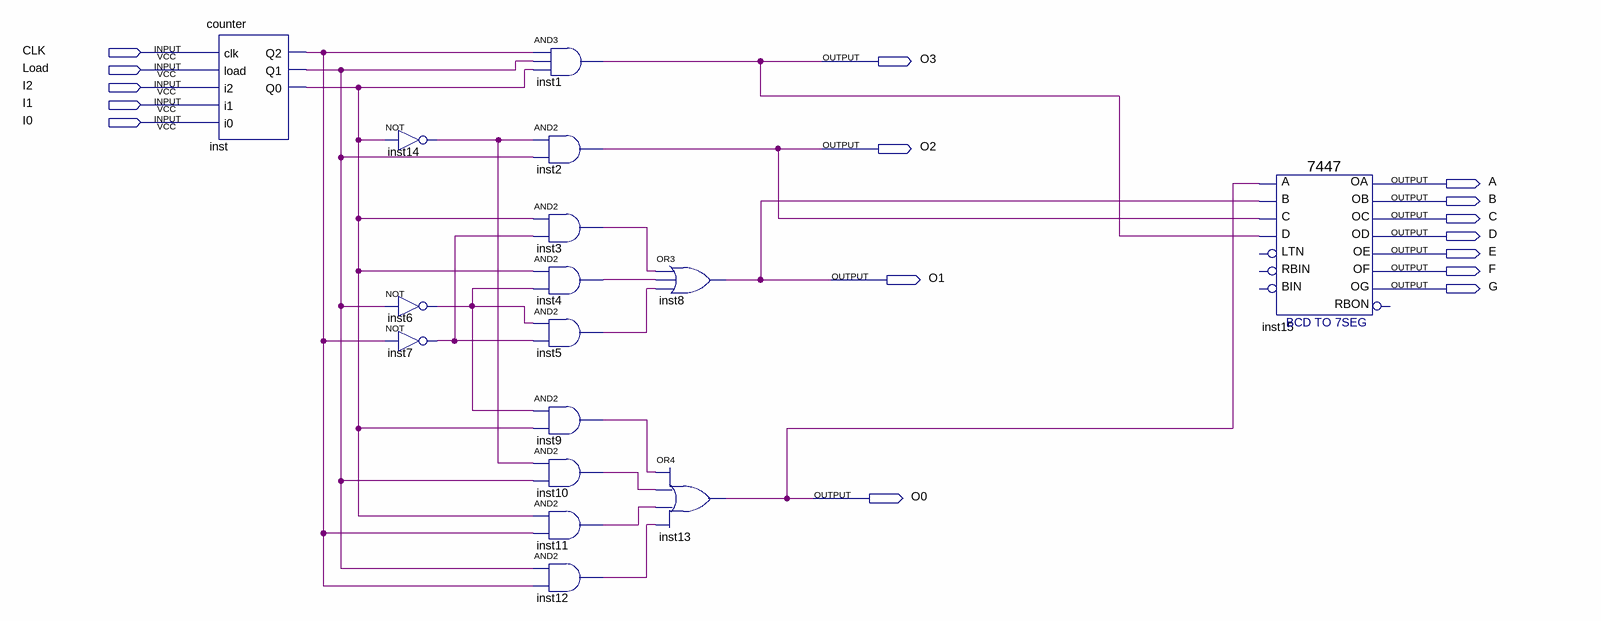
[diagram p0: schematic sheet]
// Quartus schematic MSSV_BDB.bdf as structural Verilog: 16 symbols, 16 pins
module MSSV_BDB (
  input  CLK,
  input  Load,
  input  I2,
  input  I1,
  input  I0,
  output O3,
  output O2,
  output A,
  output B,
  output C,
  output D,
  output E,
  output F,
  output O1,
  output G,
  output O0
);

  wire inst3_out, inst4_out, inst5_out, inst6_out, inst7_out, inst9_out, inst10_out, inst11_out, inst12_out,
       inst14_out, inst_q0, inst_q1, inst_q2;

  counter inst (.clk(CLK), .load(Load), .i2(I2), .i1(I1), .i0(I0), .Q2(inst_q2), .Q1(inst_q1), .Q0(inst_q0));
  not inst14 (inst14_out, inst_q0);
  not inst6 (inst6_out, inst_q1);
  not inst7 (inst7_out, inst_q2);
  and inst1 (O3, inst_q2, inst_q1, inst_q0);
  and inst2 (O2, inst14_out, inst_q1);
  and inst3 (inst3_out, inst_q0, inst7_out);
  and inst4 (inst4_out, inst_q0, inst6_out);
  and inst5 (inst5_out, inst6_out, inst7_out);
  and inst9 (inst9_out, inst6_out, inst_q0);
  and inst10 (inst10_out, inst14_out, inst_q1);
  and inst11 (inst11_out, inst_q0, inst_q2);
  and inst12 (inst12_out, inst_q1, inst_q2);
  or inst8 (O1, inst3_out, inst4_out, inst5_out);
  or inst13 (O0, inst9_out, inst10_out, inst11_out, inst12_out);
  \7447  inst15 (
    .B(O1), .C(O2), .D(O3), .A(O0), .OB(B), .OC(C), .OE(E), .OD(D), .OF(F), .OG(G), .OA(A));  // open: LTN, RBIN, BIN, RBON
endmodule
